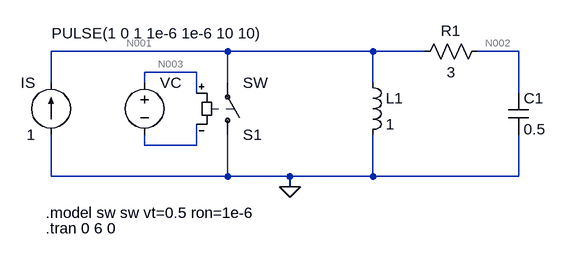
[diagram p0: schematic exercise2.asc]
exercise2.asc, the LTspice schematic file:
Version 4
SHEET 1 928 680
WIRE 432 224 160 224
WIRE 656 224 432 224
WIRE 736 224 656 224
WIRE 880 224 816 224
WIRE 384 256 304 256
WIRE 160 272 160 224
WIRE 304 272 304 256
WIRE 432 272 432 224
WIRE 656 272 656 224
WIRE 384 288 384 256
WIRE 880 288 880 224
WIRE 304 368 304 352
WIRE 384 368 384 336
WIRE 384 368 304 368
WIRE 160 416 160 352
WIRE 432 416 432 352
WIRE 432 416 160 416
WIRE 528 416 432 416
WIRE 656 416 656 352
WIRE 656 416 528 416
WIRE 880 416 880 352
WIRE 880 416 656 416
WIRE 528 432 528 416
FLAG 528 432 0
SYMBOL current 160 352 R180
WINDOW 0 24 80 Left 2
WINDOW 3 24 0 Left 2
WINDOW 123 0 0 Left 0
WINDOW 39 0 0 Left 0
SYMATTR InstName IS
SYMATTR Value 1
SYMBOL sw 432 368 M180
SYMATTR InstName S1
SYMBOL voltage 304 256 R0
WINDOW 3 -143 -60 Left 2
WINDOW 123 0 0 Left 0
WINDOW 39 0 0 Left 0
SYMATTR InstName VC
SYMATTR Value PULSE(1 0 1 1e-6 1e-6 10 10)
SYMBOL ind 640 256 R0
SYMATTR InstName L1
SYMATTR Value 1
SYMBOL cap 864 288 R0
SYMATTR InstName C1
SYMATTR Value 0.5
SYMBOL res 832 208 R90
WINDOW 0 0 56 VBottom 2
WINDOW 3 32 56 VTop 2
SYMATTR InstName R1
SYMATTR Value 3
TEXT 152 472 Left 2 !.model sw sw vt=0.5 ron=1e-6
TEXT 152 496 Left 2 !.tran 0 6 0

The netlist it stands for:
* exercise2.asc
IS 0 N001 1
S1 0 N001 N003 N004 SW
VC N003 N004 PULSE(1 0 1 1e-6 1e-6 10 10)
L1 N001 0 1
C1 N002 0 0.5
R1 N002 N001 3
.model sw sw vt=0.5 ron=1e-6
.tran 0 6 0
.backanno
.end

* Results of the author's LTspice run, read from the files saved beside the schematic
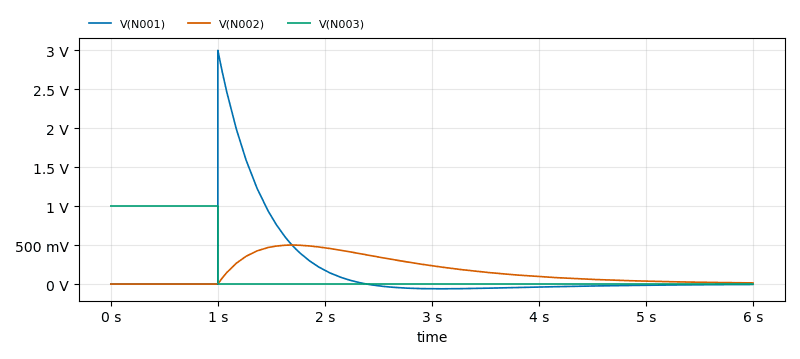
[diagram p1: Transient Analysis of exercise2.asc, plotted from the saved traces]
* Transient Analysis, 1 run:
*   V(N001): min -61.21 mV, max 2.997 V, average 169.1 mV, rms 555.6 mV, last -5.538 mV
*   V(N002): min 999 nV, max 499.6 mV, average 164.9 mV, rms 235.9 mV, last 14.39 mV
*   V(N003): min 0 V, max 1 V, average 166.7 mV, rms 408.2 mV, last 0 V